# EAGLE design TSAL_logic (EAGLE 9.6.2)

## Sheet 1 of 2
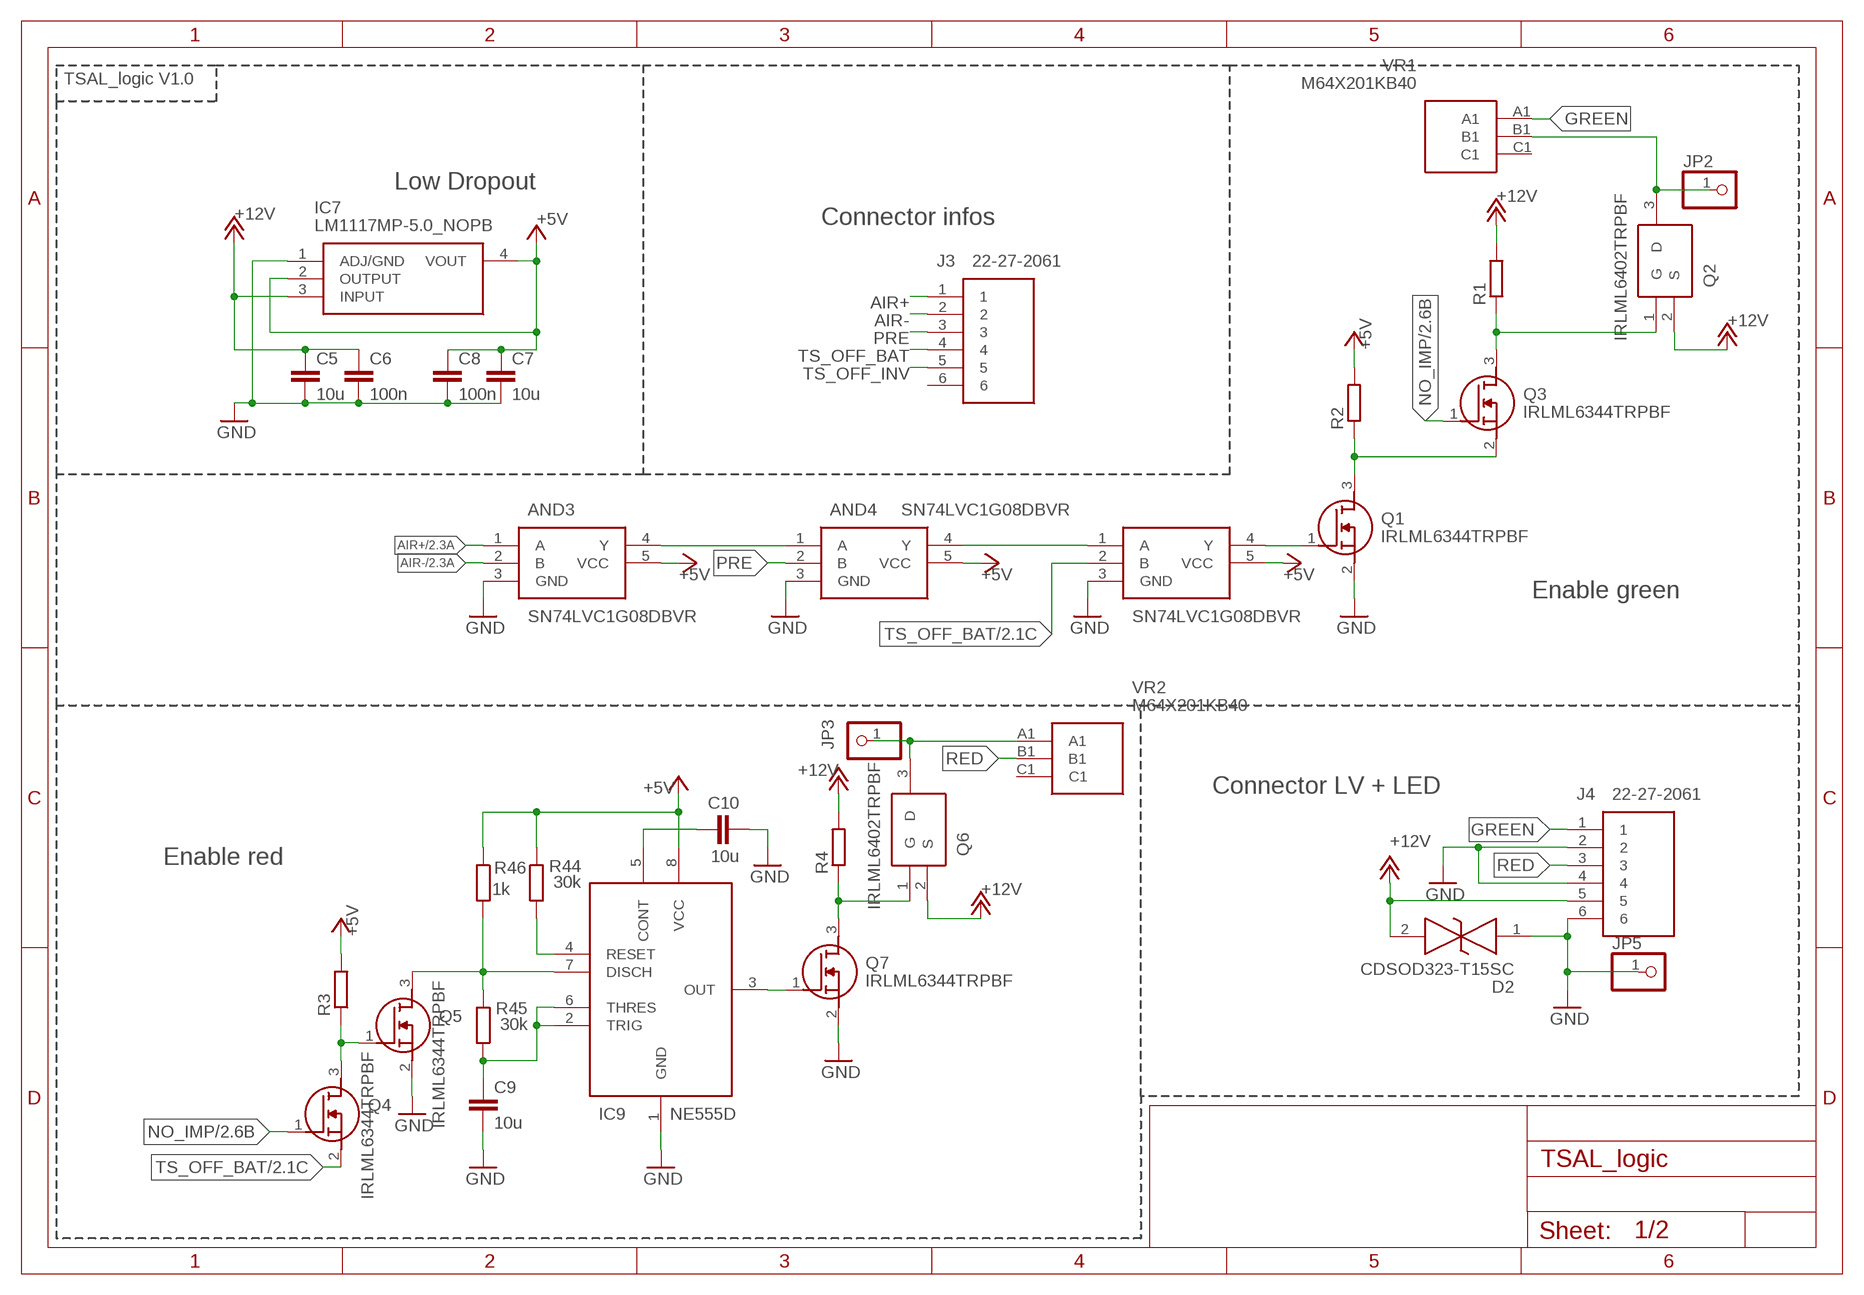
[diagram p0: schematic, sheet 1]

### Parts
AND3  SN74LVC1G08DBVR  [SOT95P280X145-5N]
AND4  SN74LVC1G08DBVR  [SOT95P280X145-5N]
AND5  SN74LVC1G08DBVR  [SOT95P280X145-5N]
C5  10u  C-EUC1206  [C1206]
C6  100n  C-EUC0603  [C0603]
C7  10u  C-EUC1206  [C1206]
C8  100n  C-EUC0603  [C0603]
C9  10u  C-EUC1206  [C1206]
C10  10u  C-EUC1206  [C1206]
D2  CDSOD323-T15SC  [SOD-323]
IC7  LM1117MP-5.0_NOPB  [SOT230P700X180-4N]
IC9  NE555D  [SOIC127P600X175-8N]
J3  22-27-2061  [HDRV6W64P0X254_1X6_1524X580X11]
J4  22-27-2061  [HDRV6W64P0X254_1X6_1524X580X11]
JP2  PINHD-1X1  [1X01]
JP3  PINHD-1X1  [1X01]
JP5  PINHD-1X1  [1X01]
Q1  IRLML6344TRPBF  [SOT95P237X112-3N]
Q2  IRLML6402TRPBF  [SOT95P237X112-3N]
Q3  IRLML6344TRPBF  [SOT95P237X112-3N]
Q4  IRLML6344TRPBF  [SOT95P237X112-3N]
Q5  IRLML6344TRPBF  [SOT95P237X112-3N]
Q6  IRLML6402TRPBF  [SOT95P237X112-3N]
Q7  IRLML6344TRPBF  [SOT95P237X112-3N]
R1  R-EU_R0603  [R0603]
R2  R-EU_R0603  [R0603]
R3  R-EU_R0603  [R0603]
R4  R-EU_R0603  [R0603]
R44  30k  R-EU_R1206  [R1206]
R45  30k  R-EU_R1206  [R1206]
R46  1k  R-EU_R1206  [R1206]
VR1  M64X201KB40  [M64X201KB40]
VR2  M64X201KB40  [M64X201KB40]

### Nets
12VN$2 [12V]: Q2.1(G) Q3.3(D) R1.1
12VN$5 [12V]: Q6.1(G) Q7.3(D) R4.1
12VN$29 [12V]: JP2.1 Q2.3(D) VR1.B1
+5V [5V]: AND3.5(VCC) AND4.5(VCC) AND5.5(VCC) C7.1 C8.1 IC7.2(OUTPUT) IC7.4(VOUT) IC9.8(VCC) R2.2 R3.2 R44.1 R46.1 ; also sheet 2
+12V [12V]: C5.1 C6.1 D2.2 IC7.3(INPUT) J4.5 Q2.2(S) Q6.2(S) R1.2 R4.2
AIR+ [5V]: AND3.1(A) J3.1 ; also sheet 2
AIR- [5V]: AND3.2(B) J3.2 ; also sheet 2
GND [GROUND]: AND3.3(GND) AND4.3(GND) AND5.3(GND) C5.2 C6.2 C7.2 C8.2 C9.2 C10.2 D2.1 IC7.1(ADJ/GND) IC9.1(GND) J4.2 J4.4 J4.6 JP5.1 Q1.2(S) Q5.2(S) Q7.2(S) ; also sheet 2
GREEN [12V]: J4.1 VR1.A1
N$1 [5V]: Q1.3(D) Q3.2(S) R2.1
N$2 [12V]: JP3.1 Q6.3(D) VR2.A1
N$3 [5V]: Q4.3(D) Q5.1(G) R3.1
N$4 [5V]: IC9.3(OUT) Q7.1(G)
N$27 [5V]: AND4.4(Y) AND5.1(A)
N$53 [5V]: AND3.4(Y) AND4.1(A)
N$58 [5V]: AND5.4(Y) Q1.1(G)
N$61 [5V]: IC9.7(DISCH) Q5.3(D) R45.2 R46.2
N$62 [5V]: C9.1 IC9.2(TRIG) IC9.6(THRES) R45.1
N$64 [5V]: IC9.4(RESET) R44.2
N$66 [5V]: C10.1 IC9.5(CONT)
NO_IMP [5V]: Q3.1(G) Q4.1(G) ; also sheet 2
PRE [5V]: AND4.2(B) J3.3
RED [12V]: J4.3 VR2.B1
TS_OFF_BAT [5V]: AND5.2(B) J3.4 Q4.2(S) ; also sheet 2
TS_OFF_INV [5V]: J3.5 ; also sheet 2
Unconnected: J3.6 VR1.C1 VR2.C1

### Notes on the sheet
- TSAL_logic V1.0
- Low Dropout
- Connector infos
- Enable green
- Connector LV + LED
- Enable red

## Sheet 2 of 2
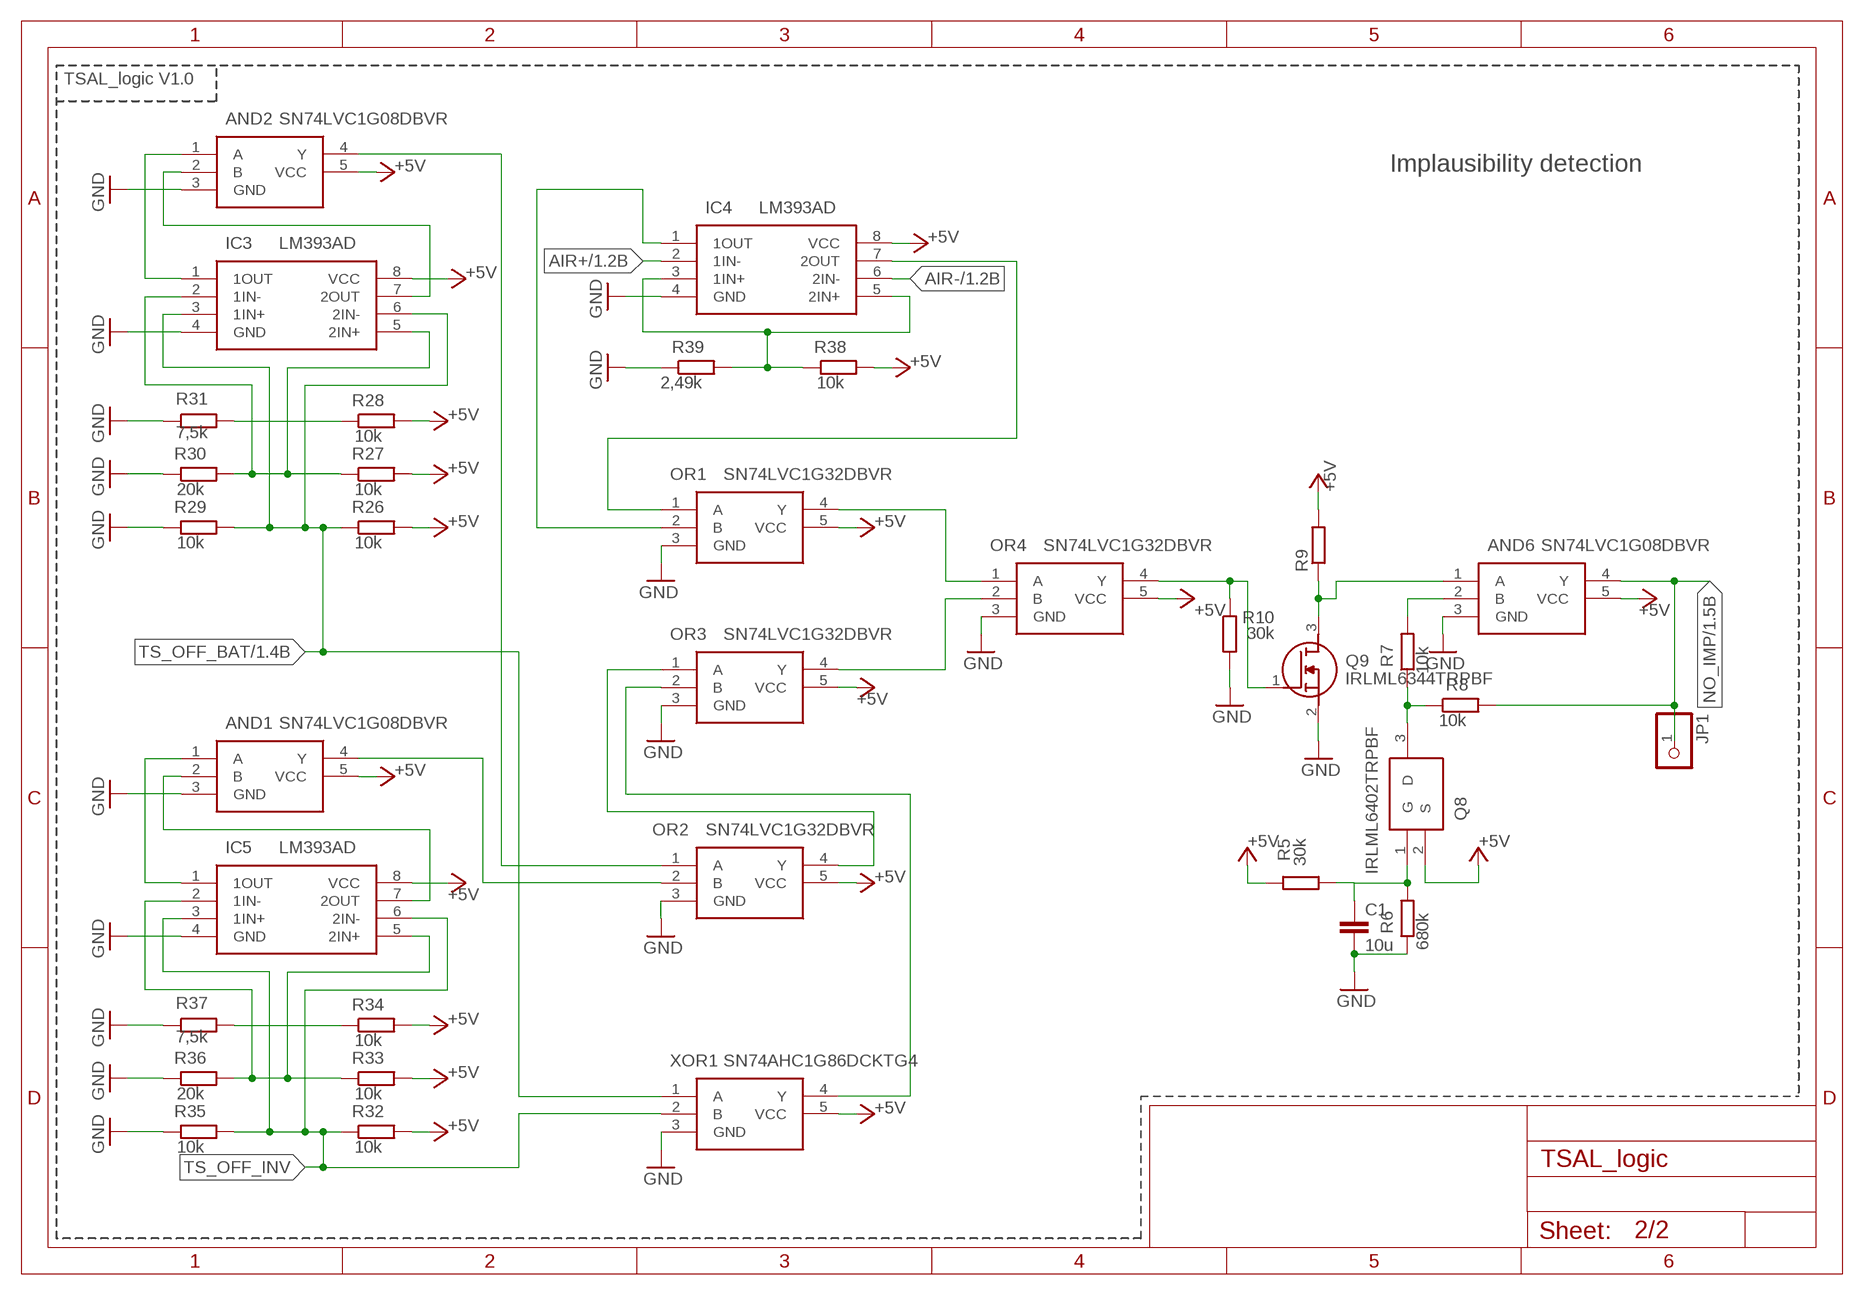
[diagram p1: schematic, sheet 2]

### Parts
AND1  SN74LVC1G08DBVR  [SOT95P280X145-5N]
AND2  SN74LVC1G08DBVR  [SOT95P280X145-5N]
AND6  SN74LVC1G08DBVR  [SOT95P280X145-5N]
C1  10u  C-EUC1206  [C1206]
IC3  LM393AD  [SOIC127P600X175-8N]
IC4  LM393AD  [SOIC127P600X175-8N]
IC5  LM393AD  [SOIC127P600X175-8N]
JP1  PINHD-1X1  [1X01]
OR1  SN74LVC1G32DBVR  [SOT95P280X145-5N]
OR2  SN74LVC1G32DBVR  [SOT95P280X145-5N]
OR3  SN74LVC1G32DBVR  [SOT95P280X145-5N]
OR4  SN74LVC1G32DBVR  [SOT95P280X145-5N]
Q8  IRLML6402TRPBF  [SOT95P237X112-3N]
Q9  IRLML6344TRPBF  [SOT95P237X112-3N]
R5  30k  R-EU_R1206  [R1206]
R6  680k  R-EU_R0603  [R0603]
R7  10k  R-EU_R0603  [R0603]
R8  10k  R-EU_R0603  [R0603]
R9  R-EU_R0603  [R0603]
R10  30k  R-EU_R1206  [R1206]
R26  10k  R-EU_R0603  [R0603]
R27  10k  R-EU_R0603  [R0603]
R28  10k  R-EU_R0603  [R0603]
R29  10k  R-EU_R0603  [R0603]
R30  20k  R-EU_R0603  [R0603]
R31  7,5k  R-EU_R0805  [R0805]
R32  10k  R-EU_R0603  [R0603]
R33  10k  R-EU_R0603  [R0603]
R34  10k  R-EU_R0603  [R0603]
R35  10k  R-EU_R0603  [R0603]
R36  20k  R-EU_R0603  [R0603]
R37  7,5k  R-EU_R0805  [R0805]
R38  10k  R-EU_R0603  [R0603]
R39  2,49k  R-EU_R0603  [R0603]
XOR1  SN74AHC1G86DCKTG4  [SOT65P210X110-5N]

### Nets
+5V [5V]: AND1.5(VCC) AND2.5(VCC) AND6.5(VCC) IC3.8(VCC) IC4.8(VCC) IC5.8(VCC) OR1.5(VCC) OR2.5(VCC) OR3.5(VCC) OR4.5(VCC) Q8.2(S) R5.1 R9.2 R26.2 R27.2 R28.2 R32.2 R33.2 R34.2 R38.2 XOR1.5(VCC) ; also sheet 1
AIR+ [5V]: IC4.2(1IN-) ; also sheet 1
AIR- [5V]: IC4.6(2IN-) ; also sheet 1
GND [GROUND]: AND1.3(GND) AND2.3(GND) AND6.3(GND) C1.2 IC3.4(GND) IC4.4(GND) IC5.4(GND) OR1.3(GND) OR2.3(GND) OR3.3(GND) OR4.3(GND) Q9.2(S) R6.1 R10.2 R29.1 R30.1 R31.1 R35.1 R36.1 R37.1 R39.1 XOR1.3(GND) ; also sheet 1
N$6 [5V]: OR2.4(Y) OR3.1(A)
N$7 [5V]: OR4.4(Y) Q9.1(G) R10.1
N$8 [5V]: C1.1 Q8.1(G) R5.2 R6.2
N$9 [5V]: AND6.2(B) R7.2
N$10 [5V]: Q8.3(D) R7.1 R8.1
N$11 [5V]: IC4.7(2OUT) OR1.1(A)
N$13 [5V]: AND1.4(Y) OR2.2(B)
N$14 [5V]: OR3.2(B) XOR1.4(Y)
N$15 [5V]: OR1.4(Y) OR4.1(A)
N$16 [5V]: AND6.1(A) Q9.3(D) R9.1
N$30 [5V]: R28.1 R31.2
N$31 [5V]: IC3.2(1IN-) IC3.5(2IN+) R27.1 R30.2
N$33 [5V]: AND2.1(A) IC3.1(1OUT)
N$34 [5V]: AND2.2(B) IC3.7(2OUT)
N$35 [5V]: R34.1 R37.2
N$36 [5V]: IC5.2(1IN-) IC5.5(2IN+) R33.1 R36.2
N$38 [5V]: AND1.2(B) IC5.7(2OUT)
N$39 [5V]: AND1.1(A) IC5.1(1OUT)
N$40 [5V]: IC4.3(1IN+) IC4.5(2IN+) R38.1 R39.2
N$43 [5V]: IC4.1(1OUT) OR1.2(B)
N$50 [5V]: AND2.4(Y) OR2.1(A)
N$63 [5V]: OR3.4(Y) OR4.2(B)
NO_IMP [5V]: AND6.4(Y) JP1.1 R8.2 ; also sheet 1
TS_OFF_BAT [5V]: IC3.3(1IN+) IC3.6(2IN-) R26.1 R29.2 XOR1.1(A) ; also sheet 1
TS_OFF_INV [5V]: IC5.3(1IN+) IC5.6(2IN-) R32.1 R35.2 XOR1.2(B) ; also sheet 1

### Notes on the sheet
- TSAL_logic V1.0
- Implausibility detection

## Library data of the parts
AND1-AND6 = SamacSys_Parts:SN74LVC1G08DBVR: SN74LVC1G08 Single 2-Input Positive-AND Gate Source: Datasheet <http://www.ti.com/lit/ds/symlink/sn74lvc1g08.pdf>; ARROW_PART_NUMBER: SN74LVC1G08DBVR; ARROW_PRICE-STOCK: https://www.arrow.com/en/products/sn74lvc1g08dbvr/texas-instruments?region=nac; DESCRIPTION: SN74LVC1G08 Single 2-Input Positive-AND Gate; HEIGHT: 1.45mm; MANUFACTURER_NAME: Texas Instruments; MANUFACTURER_PART_NUMBER: SN74LVC1G08DBVR; MOUSER_PART_NUMBER: 595-SN74LVC1G08DBVR; MOUSER_PRICE-STOCK: https://www.mouser.co.uk/ProductDetail/Texas-Instruments/SN74LVC1G08DBVR?qs=8yeEWhuAOtNjtL049wSCoQ%3D%3D
C1 C5-C10 = rcl:C-EU: CAPACITOR, European symbol; SPICEPREFIX: C
D2 = SamacSys_Parts:CDSOD323-T15SC: TVS Diode ESD 15V BiDirectional SOD323 Bourns CDSOD323-T15SC Bi-Directional TVS Diode, 400W peak, 2-Pin SOD-323 Source: Datasheet <http://uk.rs-online.com/web/p/products/7734570>; ALLIED_NUMBER: 70410859; DESCRIPTION: TVS Diode ESD 15V BiDirectional SOD323 Bourns CDSOD323-T15SC Bi-Directional TVS Diode, 400W peak, 2-Pin SOD-323; HEIGHT: mm; MANUFACTURER_NAME: Bourns; MANUFACTURER_PART_NUMBER: CDSOD323-T15SC; RS_PART_NUMBER: 7734570; RS_PRICE-STOCK: http://uk.rs-online.com/web/p/products/7734570
IC3-IC5 = SamacSys_Parts:LM393AD: LM393ADG4, Dual Comparator Open Collector 1.3s 2-kanalers 3, 5, 9, 12, 15, 18, 24, 28V 8-Pin SOIC Source: Datasheet <http://uk.rs-online.com/web/p/products/5171905P>; DESCRIPTION: LM393ADG4, Dual Comparator Open Collector 1.3s 2-kanalers 3, 5, 9, 12, 15, 18, 24, 28V 8-Pin SOIC; HEIGHT: 1.75mm; MANUFACTURER_NAME: Texas Instruments; MANUFACTURER_PART_NUMBER: LM393AD; RS_PART_NUMBER: 5171905P; RS_PRICE-STOCK: http://uk.rs-online.com/web/p/products/5171905P
IC7 = SamacSys_Parts:LM1117MP-5.0_NOPB: LM1117MP-5.0/NOPB, Low Dropout Voltage Regulator, 1.5A, 5 V +/-1%, 4-Pin SOT-223 Source: Datasheet <https://datasheet.datasheetarchive.com/originals/distributors/Datasheets-SFU2/DSASFU100036103.pdf>; ARROW_PART_NUMBER: LM1117MP-5.0/NOPB; ARROW_PRICE-STOCK: https://www.arrow.com/en/products/lm1117mp-5.0nopb/texas-instruments?region=nac; DESCRIPTION: LM1117MP-5.0/NOPB, Low Dropout Voltage Regulator, 1.5A, 5 V +/-1%, 4-Pin SOT-223; HEIGHT: 1.8mm; MANUFACTURER_NAME: Texas Instruments; MANUFACTURER_PART_NUMBER: LM1117MP-5.0/NOPB; MOUSER_PART_NUMBER: 926-LM1117MP-5.0NOPB; MOUSER_PRICE-STOCK: https://www.mouser.co.uk/ProductDetail/Texas-Instruments/LM1117MP-50-NOPB?qs=X1J7HmVL2ZFGlzwnAaPsKg%3D%3D
IC9 = SamacSys_Parts:NE555D: NE555DG4, Timer, 4.5 to 16V, 8-Pin SOIC-8 Source: Datasheet <http://uk.rs-online.com/web/p/products/6624661P>; DESCRIPTION: NE555DG4, Timer, 4.5 to 16V, 8-Pin SOIC-8; HEIGHT: 1.75mm; MANUFACTURER_NAME: Texas Instruments; MANUFACTURER_PART_NUMBER: NE555D; RS_PART_NUMBER: 6624661P; RS_PRICE-STOCK: http://uk.rs-online.com/web/p/products/6624661P
J3 J4 = SamacSys_Parts:22-27-2061: 6way straight PCB header w/friction lock Molex KK Series, Series Number 6410, 2.54mm Pitch 6 Way 1 Row Straight PCB Header, Solder Termination, 4A Source: Datasheet <http://uk.rs-online.com/web/p/products/4838506P>; DESCRIPTION: 6way straight PCB header w/friction lock Molex KK Series, Series Number 6410, 2.54mm Pitch 6 Way 1 Row Straight PCB Header, Solder Termination, 4A; HEIGHT: 11.7mm; MANUFACTURER_NAME: Molex; MANUFACTURER_PART_NUMBER: 22-27-2061; RS_PART_NUMBER: 4838506P; RS_PRICE-STOCK: http://uk.rs-online.com/web/p/products/4838506P
JP1-JP3 JP5 = pinhead:PINHD-1X1: PIN HEADER
OR1 OR2 OR4 = SamacSys_Parts:SN74LVC1G32DBVR: Texas Instruments SN74LVC1G32DBVR, 2-Input OR Logic Gate, 1.65 5.5 V, 5-Pin SOT-23 Source: Datasheet <http://uk.rs-online.com/web/p/products/0527669>; DESCRIPTION: Texas Instruments SN74LVC1G32DBVR, 2-Input OR Logic Gate, 1.65 5.5 V, 5-Pin SOT-23; HEIGHT: 1.45mm; MANUFACTURER_NAME: Texas Instruments; MANUFACTURER_PART_NUMBER: SN74LVC1G32DBVR; RS_PART_NUMBER: 0527669; RS_PRICE-STOCK: http://uk.rs-online.com/web/p/products/0527669
OR3 = SamacSys_Parts:SN74LVC1G32DBVR: Texas Instruments SN74LVC1G32DBVR, 2-Input OR Logic Gate, 1.65 5.5 V, 5-Pin SOT-23 Source: Datasheet <http://uk.rs-online.com/web/p/products/0527669>; DESCRIPTION: Texas Instruments SN74LVC1G32DBVR, 2-Input OR Logic Gate, 1.65 5.5 V, 5-Pin SOT-23; HEIGHT: 1.45mm; MANUFACTURER_NAME: Texas Instruments; MANUFACTURER_PART_NUMBER: SN74LVC1G32DBVR; RS_PART_NUMBER: 0527669; RS_PRICE-STOCK: http://uk.rs-online.com/web/p/products/0527669; SPICEPREFIX: X
Q1 Q3-Q5 Q7 Q9 = SamacSys_Parts:IRLML6344TRPBF: IRLML6344TRPBF N-channel MOSFET Transistor, 5 A, 30 V, 3-Pin SOT-23 Source: Datasheet <http://uk.rs-online.com/web/p/products/7377225P>; ALLIED_NUMBER: 70411467; DESCRIPTION: IRLML6344TRPBF N-channel MOSFET Transistor, 5 A, 30 V, 3-Pin SOT-23; HEIGHT: 1.12mm; MANUFACTURER_NAME: Infineon; MANUFACTURER_PART_NUMBER: IRLML6344TRPBF; RS_PART_NUMBER: 7377225P; RS_PRICE-STOCK: http://uk.rs-online.com/web/p/products/7377225P
Q2 Q6 Q8 = SamacSys_Parts:IRLML6402TRPBF: MOSFET MOSFT P-Ch -3.7A 65mOhm 8nC Log Lvl Source: Datasheet <http://uk.rs-online.com/web/p/products/0301322P>; ALLIED_NUMBER: 70017407; DESCRIPTION: MOSFET MOSFT P-Ch -3.7A 65mOhm 8nC Log Lvl; HEIGHT: 1.12mm; MANUFACTURER_NAME: Infineon; MANUFACTURER_PART_NUMBER: IRLML6402TRPBF; RS_PART_NUMBER: 0301322P; RS_PRICE-STOCK: http://uk.rs-online.com/web/p/products/0301322P
R1-R10 R26-R39 R44-R46 = rcl:R-EU_: RESISTOR, European symbol; SPICEPREFIX: R
VR1 VR2 = SamacSys_Parts:M64X201KB40: Trimmer Resistors - Through Hole 3/8"SQ 200ohms Multi Turn Cermet Source: Datasheet <https://www.mouser.co.uk/datasheet/2/427/64-239937.pdf>; ARROW_PART_NUMBER: M64X201KB40; ARROW_PRICE-STOCK: https://www.arrow.com/en/products/m64x201kb40/vishay; DESCRIPTION: Trimmer Resistors - Through Hole 3/8"SQ 200ohms Multi Turn Cermet; HEIGHT: 9.8mm; MANUFACTURER_NAME: Vishay; MANUFACTURER_PART_NUMBER: M64X201KB40; MOUSER_PART_NUMBER: 594-64X201; MOUSER_PRICE-STOCK: https://www.mouser.com/Search/Refine.aspx?Keyword=594-64X201
XOR1 = SamacSys_Parts:SN74AHC1G86DCKTG4: Logic Gates Single 2 Input Exclusive OR Gate Source: Datasheet <https://www.ti.com/general/docs/suppproductinfo.tsp?distId=10&gotoUrl=http://www.ti.com/lit/gpn/sn74ahc1g86>; ARROW_PART_NUMBER: SN74AHC1G86DCKTG4; ARROW_PRICE-STOCK: https://www.arrow.com/en/products/sn74ahc1g86dcktg4/texas-instruments; DESCRIPTION: Logic Gates Single 2 Input Exclusive OR Gate; HEIGHT: 1.1mm; MANUFACTURER_NAME: Texas Instruments; MANUFACTURER_PART_NUMBER: SN74AHC1G86DCKTG4; MOUSER_PART_NUMBER: 595-74AHC1G86DCKTG4; MOUSER_PRICE-STOCK: https://www.mouser.co.uk/ProductDetail/Texas-Instruments/SN74AHC1G86DCKTG4?qs=E8lYj0tdJGGGs7zAY6mT0w%3D%3D

## Net classes
1 GROUND: width 0.5 mm, drill 0.401 mm, clearance 0.051 mm
2 12V: width 1 mm, drill 0.401 mm, clearance 0.051 mm
4 5V: width 0.5 mm, drill 0.401 mm, clearance 0.051 mm

## Board
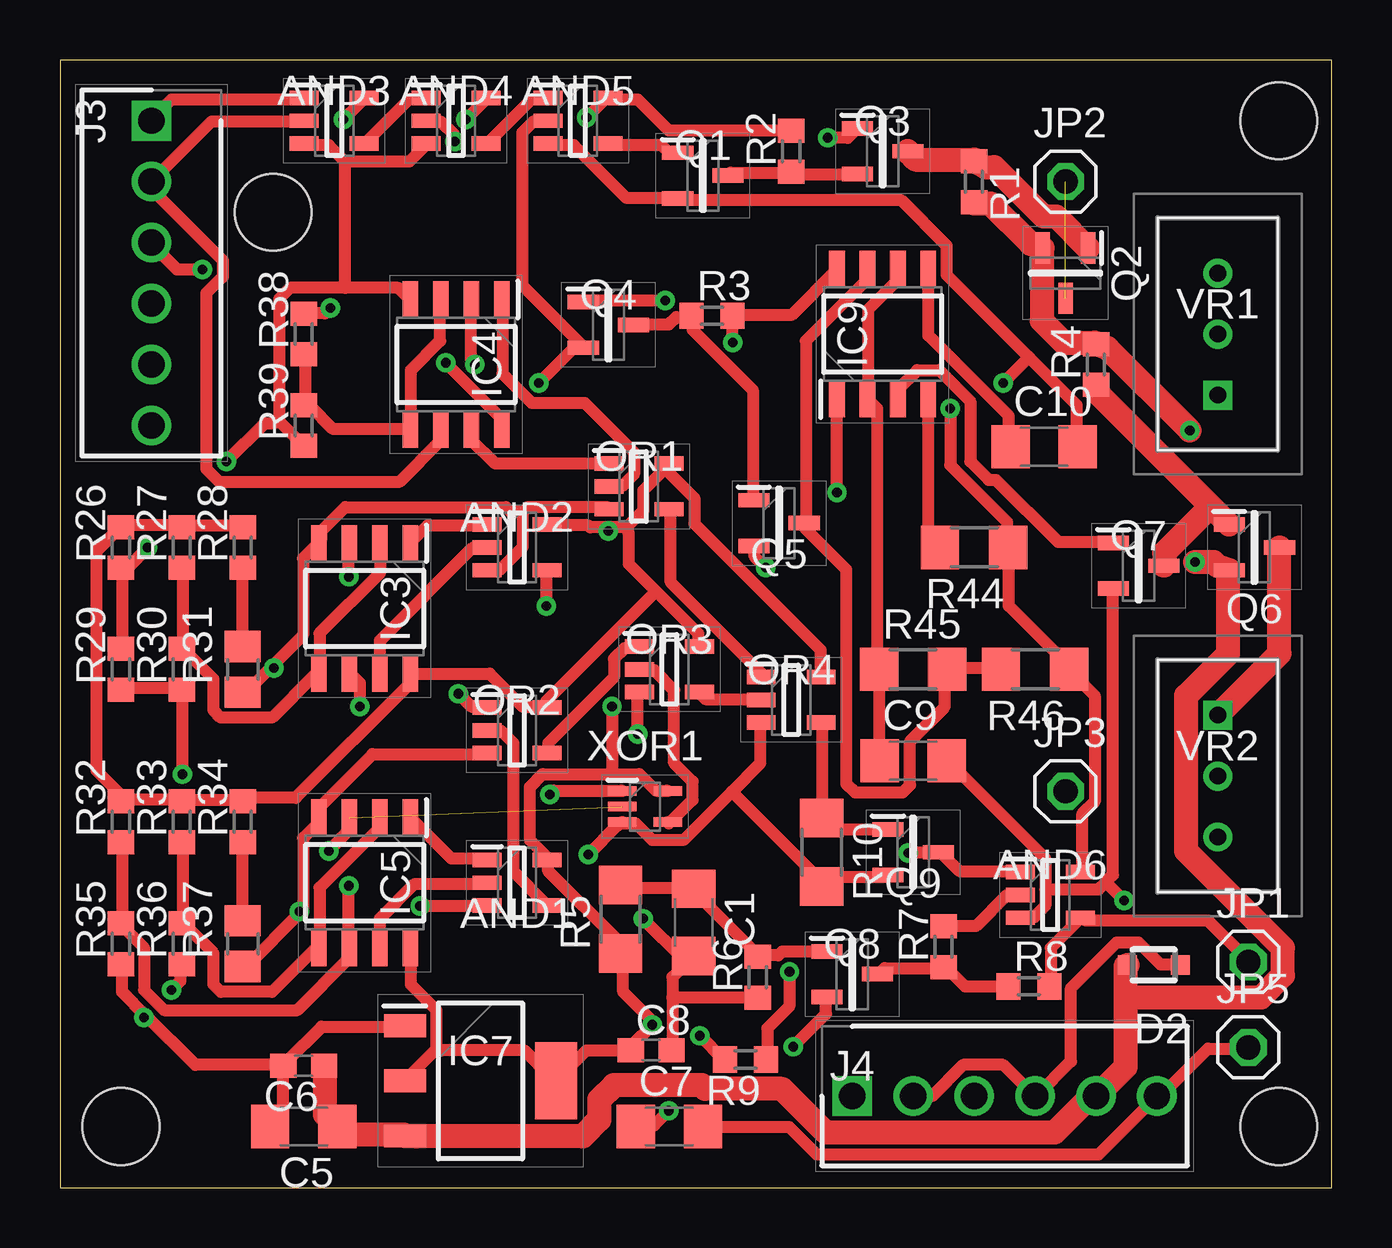
[diagram p2: board, top side]
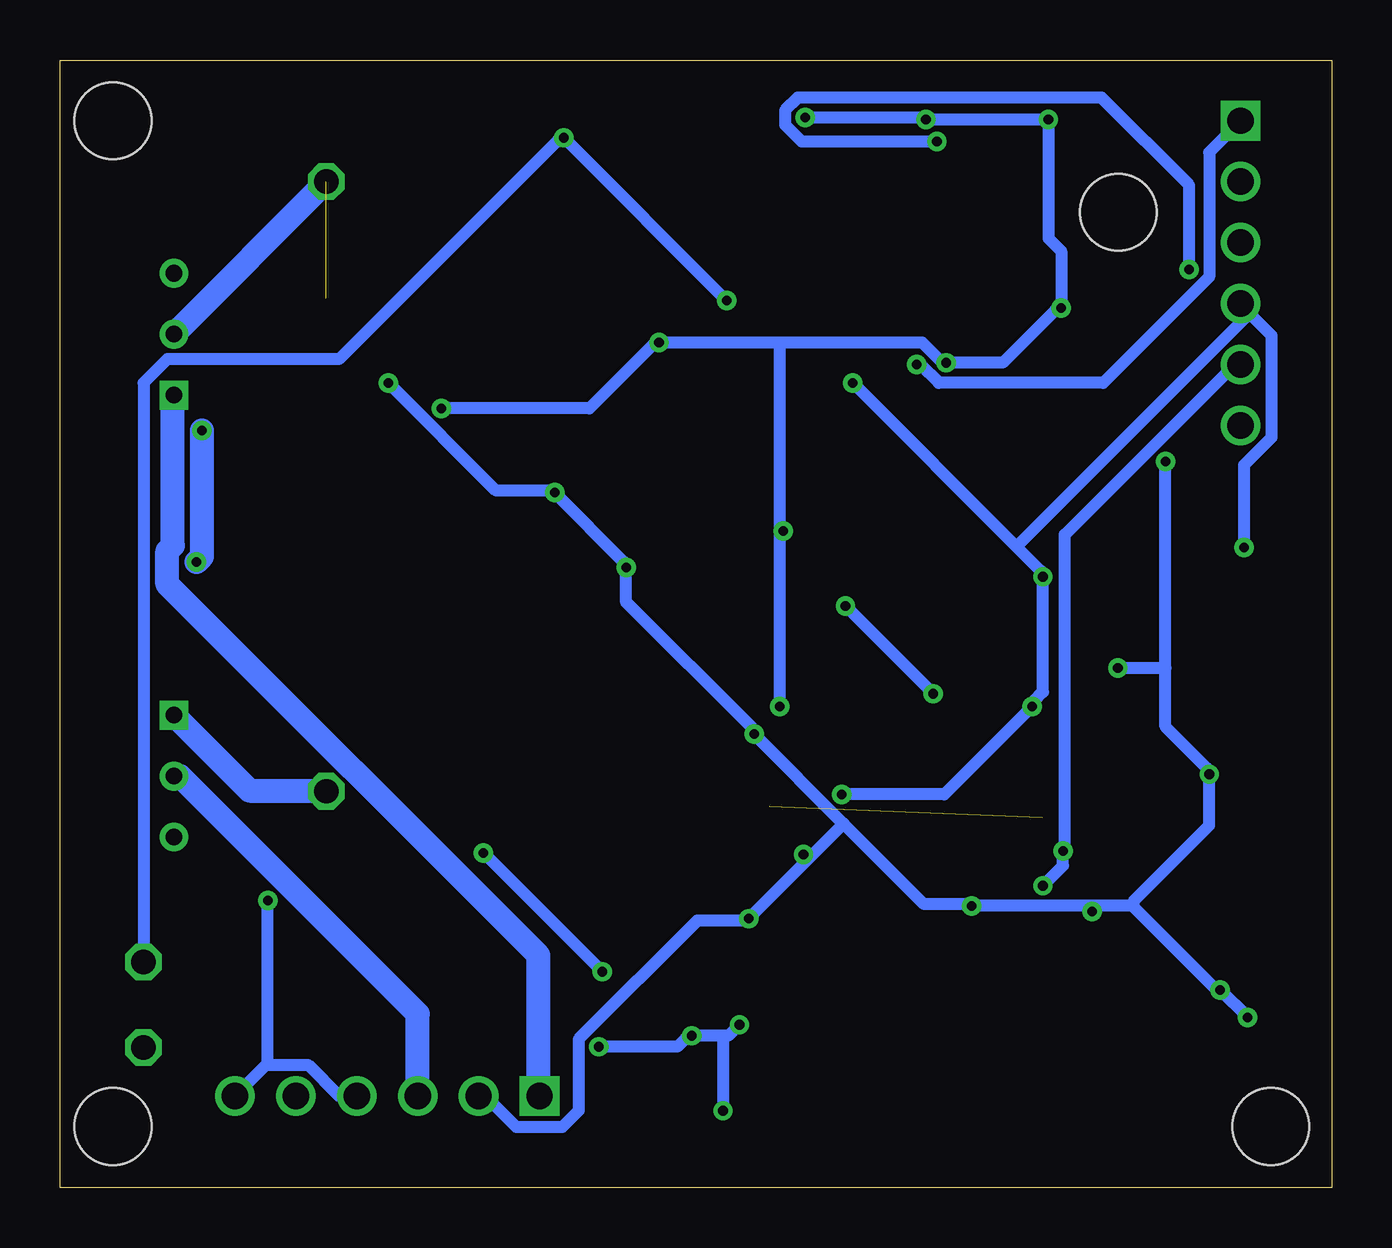
[diagram p3: board, bottom side, seen from below]

Size 53.01 x 46.98 mm. Coordinates in mm from the lower left corner, seen from the top.
Outline: 0,0 53.01,0 53.01,46.98 0,46.98 0,0
Copper layers (1*16): Top 0.035mm / dielectric 1.5mm / Bottom 0.035mm
Design rules "default": minimum track width 6mil, minimum drill 0.35mm, track to track 6mil, track to pad 6mil, pad to pad 6mil, via to via 6mil, smd to smd 6mil, copper to edge 40mil, drill to drill 6mil, minimum pad ring 10mil, minimum via ring 8mil, stop-mask expansion 4mil, vias tented up to drill 0mil, thermal gap 10mil
Holes 3.2 mm at 2.54,2.54 50.8,2.54 50.8,44.45 8.89,40.64

### Footprints (pad centres in the part's own frame; a part is rotated, then mirrored left to right if it is on the bottom)
SOT95P280X145-5N = smd 1.2 x 0.6: 1 -1.25,0.95; 2 -1.25,0; 3 -1.25,-0.95; 4 1.25,-0.95; 5 1.25,0.95
C1206 = smd 1.6 x 1.8: 1 -1.4,0; 2 1.4,0
C0603 = smd 1.1 x 1: 1 -0.85,0; 2 0.85,0
SOD-323 = smd 0.8 x 0.8: 1 -1.1,0; 2 1.1,0
SOIC127P600X175-8N = smd 1.528 x 0.65: 1 -2.711,1.905; 2 -2.711,0.635; 3 -2.711,-0.635; 4 -2.711,-1.905; 5 2.711,-1.905; 6 2.711,-0.635; 7 2.711,0.635; 8 2.711,1.905
SOT230P700X180-4N = smd 1.75 x 0.95: 1 -3.15,2.3; 2 -3.15,0; 3 -3.15,-2.3 | smd 1.75 x 3.2: 4 3.15,0
HDRV6W64P0X254_1X6_1524X580X11 = drill 1.1 pad 1.65 square: 1 0,0 | drill 1.1 pad 1.65: 2 2.54,0; 3 5.08,0; 4 7.62,0; 5 10.16,0; 6 12.7,0
1X01 = drill 1.016 octagon: 1 0,0
SOT95P237X112-3N = smd 1.3 x 0.6: 1 -1.05,0.95; 2 -1.05,-0.95; 3 1.05,0
R0603 = smd 1 x 1.1: 1 -0.85,0; 2 0.85,0
R1206 = smd 1.6 x 1.803: 1 -1.422,0; 2 1.422,0
R0805 = smd 1.3 x 1.5: 1 -0.95,0; 2 0.95,0
M64X201KB40 = drill 0.7 pad 1.2 square: A1 0,0 | drill 0.7 pad 1.2: B1 0,-2.54; C1 0,-5.08
SOT65P210X110-5N = smd 1.2 x 0.4: 1 -0.95,0.65; 2 -0.95,0; 3 -0.95,-0.65; 4 0.95,-0.65; 5 0.95,0.65

### Placement (x,y rotation side)
AND1  19.05,12.7 0 top
AND2  19.05,26.67 0 top
AND3  11.43,44.45 0 top
AND4  16.51,44.45 0 top
AND5  21.59,44.45 0 top
AND6  41.27,12.19 0 top
C1  26.42,11.05 270 top
C5  10.16,2.54 180 top
C6  10.16,5.08 180 top
C7  25.4,2.54 0 top
C8  24.64,5.71 0 top
C9  35.56,17.78 0 top
C10  41.02,30.86 0 top
D2  45.59,9.27 180 top
IC3  12.7,24.13 270 top
IC4  16.51,34.29 270 top
IC5  12.7,12.7 270 top
IC7  17.53,4.45 0 top
IC9  34.29,35.56 90 top
J3  3.81,44.45 270 top
J4  33.02,3.81 0 top
JP1  49.53,9.4 0 top
JP2  41.91,41.91 0 top
JP3  41.91,16.51 0 top
JP5  49.53,5.84 0 top
OR1  24.13,29.21 0 top
OR2  19.05,19.05 0 top
OR3  25.4,21.59 0 top
OR4  30.48,20.32 0 top
Q1  26.8,42.16 0 top
Q2  41.91,38.1 270 top
Q3  34.29,43.18 0 top
Q4  22.86,35.94 0 top
Q5  29.97,27.69 0 top
Q6  49.78,26.67 0 top
Q7  44.96,25.91 0 top
Q8  33.02,8.89 0 top
Q9  35.56,13.97 0 top
R1  38.1,41.91 270 top
R2  30.48,43.18 90 top
R3  27.18,36.32 0 top
R4  43.18,34.29 90 top
R5  23.37,11.18 90 top
R6  29.08,8.76 90 top
R7  36.83,10.03 90 top
R8  40.39,8.38 0 top
R9  28.57,5.33 180 top
R10  31.75,13.97 270 top
R26  2.54,26.67 90 top
R27  5.08,26.67 90 top
R28  7.62,26.67 90 top
R29  2.54,21.59 90 top
R30  5.08,21.59 90 top
R31  7.62,21.59 90 top
R32  2.54,15.24 90 top
R33  5.08,15.24 90 top
R34  7.62,15.24 90 top
R35  2.54,10.16 90 top
R36  5.08,10.16 90 top
R37  7.62,10.16 90 top
R38  10.16,35.56 90 top
R39  10.16,31.75 90 top
R44  38.1,26.67 180 top
R45  35.56,21.59 0 top
R46  40.64,21.59 180 top
VR1  48.26,33.02 180 top
VR2  48.26,19.68 0 top
XOR1  24.38,15.88 0 top

### Tracks (layer width: path | path; a pad name or v marks a point on that pad's centre or on a via)
12VN$2
  Top 1: Q3.3 35.36,43.13 35.66,42.82 38.1,42.82 R1.1 38.56,42.52 38.94,42.52 41,40.46 41.53,40.46 42.82,39.17 Q2.1
12VN$5
  Top 1: 47.97,28.38 48.69,27.66 Q6.1 | 47.97,28.38 43.2,33.15 43.2,33.38 R4.1 | 47.97,28.38 46.02,26.44 46.02,25.91 Q7.3
12VN$29  (1 unrouted)
  Bottom 1: JP2.1 VR1.B1
+5V  (via drill 0.4)
  Top 0.5: 23.62,27.51 22.86,27.51 | 22.86,27.51 22.1,27.51 22.02,27.58 20.34,27.58 AND2.5 | 23.62,27.51 24.31,28.19 24.31,29.03 25.22,29.95 | 25.22,29.95 25.38,30.1 OR1.5 | 25.22,29.95 26.44,28.73 26.44,27.66 31.7,22.4 31.7,21.34 OR4.5 | 24.84,24.84 23.7,25.98 23.7,27.28 23.62,27.51 | 24.84,24.84 26.59,23.09 26.59,22.55 OR3.5 | R28.2 7.62,27.58 5.33,27.58 R27.2 5.03,27.58 2.59,27.58 R26.2 2.36,27.36 1.52,26.52 1.52,17.37 2.52,16.38 R32.2 2.59,16.15 5.03,16.15 R33.2 5.33,16.15 7.62,16.15 R34.2 7.85,16.23 9.83,16.23 14.55,20.95 14.55,21.18 IC3.8 14.63,21.41 17.91,21.41 19.28,20.04 20.27,20.04 OR2.5 20.27,20.27 24.84,24.84 | 23.01,17.22 20.12,17.22 19.58,16.69 19.58,14.48 20.19,13.87 AND1.5 20.34,13.64 20.34,13.18 23.32,10.21 23.32,9.83 R5.1 23.47,9.53 23.47,8.15 24.61,7.01 v24.69,6.78 23.85,5.94 C8.1 21.95,5.71 20.73,4.5 IC7.4 20.5,4.57 19.36,5.71 15.93,5.71 15.7,5.79 | 23.01,17.22 24.16,17.22 24.84,16.54 25.3,16.54 XOR1.5 | 15.7,5.79 15.7,7.39 14.63,8.46 14.63,9.98 IC5.8 | 15.7,5.79 14.4,4.5 IC7.2 | v26.67,6.33 27.66,5.33 R9.2 | v30.56,5.87 31.93,7.24 31.93,7.92 Q8.2 | v25.38,3.2 24.77,2.59 24,2.59 C7.1 | AND6.5 42.6,13.18 42.6,15.54 43.13,16.08 43.13,20.5 42.06,21.57 R46.1 41.99,21.79 39.55,24.23 39.55,26.67 R44.1 39.47,26.9 39.47,27.74 37.11,30.1 v37.11,32.46 | R2.2 30.48,44.04 25.38,44.04 24.08,45.34 22.86,45.34 AND5.5 22.63,45.26 v21.95,44.58 | IC9.8 32.38,38.25 30.48,36.35 28.04,36.35 R3.2 28.04,36.12 v28.04,35.2 | v11.28,36.65 11.05,36.42 10.21,36.42 R38.2 | v11.81,44.5 12.65,45.34 AND3.5 | v16.92,44.5 17.75,45.34 AND4.5 | v16.08,34.37 18.36,32.08 18.36,31.62 IC4.8
  Top 0.5: v23.01,20.04 23.01,17.22 | v22.86,27.36 22.86,27.51
  Bottom 0.5: 25.38,6.33 25.15,6.33 v24.69,6.78 | 25.38,6.33 v26.67,6.33 26.9,6.25 27.28,5.87 v30.56,5.87 | 25.38,6.33 v25.38,3.2 | 23.01,35.2 17.07,35.2 16.31,34.44 v16.08,34.37 13.72,34.37 11.51,36.58 v11.28,36.65 11.28,39.01 11.81,39.55 v11.81,44.5 v16.92,44.5 17.14,44.58 v21.95,44.58 | 23.01,35.2 v28.04,35.2 28.27,35.13 30.94,32.46 v37.11,32.46 | 23.01,35.2 23.01,27.36 | 23.01,27.36 v23.01,20.04 | v22.86,27.36 23.01,27.36
+12V  (via drill 0.4)
  Top 1: 40.92,39.09 40.92,36.12 41.83,35.2 43.13,35.2 R4.2 43.66,34.98 v47.09,31.55 | 40.92,39.09 Q2.2 | R1.2 38.1,41 38.79,41 40.46,39.32 40.92,39.09 | C6.1 11.05,5.03 11.05,3.05 11.51,2.59 C5.1 12.04,2.36 12.19,2.21 14.33,2.21 IC7.3 14.86,2.13 21.79,2.13 22.48,2.82 22.48,3.66 23.09,4.27 26.75,4.27 26.9,4.12 30.1,4.12 31.93,2.29 41.45,2.29 42.75,3.58 J4.5 43.2,3.81 44.42,5.03 44.42,7.92 | 44.42,7.92 44.42,9.22 D2.2 | 44.42,7.92 50.06,7.92 50.98,8.84 50.98,9.98 46.94,14.02 46.94,20.5 48.69,22.25 48.69,25.68 Q6.2 48.23,25.91 48.08,26.06 v47.32,26.06
  Bottom 1: v47.09,31.55 47.09,26.29 v47.32,26.06
AIR+  (via drill 0.4)
  Top 0.5: AND3.1 10.13,45.34 4.65,45.34 3.81,44.5 J3.1 | IC4.2 17.14,34.44 v17.3,34.29
  Bottom 0.5: v17.3,34.29 17.14,34.29 16.38,33.53 9.53,33.53 5.11,37.95 5.11,43.13 3.81,44.42 J3.1
AIR-
  Top 0.5: AND3.2 10.13,44.42 6.33,44.42 J3.2 3.73,41.68 6.78,38.63 6.78,37.95 6.1,37.26 6.1,29.95 6.63,29.41 14.17,29.41 15.85,31.09 15.85,31.55 IC4.6
GND  (via drill 0.4)
  Top 0.5: 41.07,12.42 41.07,13.72 37.03,17.75 C9.2 | 41.07,12.42 41.07,11.73 40.62,11.28 40.08,11.28 AND6.3 | 43.59,12.72 43.28,12.42 41.07,12.42 | 43.59,12.72 43.89,13.03 43.89,24.92 Q7.2 | D2.1 46.63,9.3 45.87,9.3 44.96,10.21 44.04,10.21 42.14,8.31 42.14,5.26 40.69,3.81 J4.4 40.46,3.96 39.32,5.11 37.64,5.11 36.35,3.81 J4.2 | C7.2 26.82,2.52 30.4,2.52 31.55,1.37 43.28,1.37 J4.6 45.95,3.89 47.85,5.79 49.53,5.79 JP5.1 | v44.35,11.96 43.59,12.72 | AND5.3 20.34,43.43 21.41,43.43 23.62,41.22 25.68,41.22 Q1.2 25.98,41.15 35.05,41.15 36.96,39.24 36.96,38.02 40.39,34.59 | 40.39,34.59 42.37,32.61 42.37,30.86 C10.2 | 19.28,28.12 19.28,26.67 18.36,25.76 17.83,25.76 AND2.3 | 19.28,28.12 19.51,28.35 22.78,28.35 22.86,28.27 OR1.3 | 8.84,21.72 10.13,23.01 10.13,26.21 10.74,26.82 IC3.4 10.9,27.05 10.9,27.36 11.89,28.35 18.59,28.35 18.75,28.19 19.05,28.19 19.28,28.12 | 8.84,21.72 7.77,20.65 R31.1 | OR2.3 17.75,18.06 13.03,18.06 10.82,15.85 10.82,15.47 IC5.4 10.74,15.16 10.13,14.55 10.13,11.58 10.02,11.47 | 10.02,11.47 7.77,9.22 R37.1 | Q9.2 34.44,12.95 32.16,12.95 31.77,12.57 R10.2 31.7,12.8 28,16.5 | 28,16.5 29.18,17.68 29.18,19.36 OR4.3 | 28,16.5 25.98,14.48 24.69,14.48 24,15.16 23.47,15.16 XOR1.3 23.24,15.09 v22.02,13.87 | 11.89,42.75 11.2,43.43 10.21,43.43 AND3.3 | 11.89,42.75 14.55,42.75 15.24,43.43 AND4.3 | 9.14,31.93 10.13,30.94 R39.1 | 9.14,31.93 9.14,37.03 9.6,37.49 11.89,37.49 | 11.89,37.49 14.1,37.49 14.55,37.03 IC4.4 | 11.89,37.49 11.89,42.75 | 25.53,7.92 25.53,8.76 26.36,9.6 C1.2 25.98,9.53 v24.31,11.2 | 25.53,7.92 25.53,5.71 C8.2 | 25.53,7.92 29.03,7.92 R6.1 | R29.1 2.59,20.8 5.03,20.8 R30.1 5.11,20.5 v5.11,17.22
  Top 0.5: C6.2 9.3,5.03 9.3,3.12 8.76,2.59 C5.2 | 3.58,7.16 5.64,5.11 9.07,5.11 C6.2 | 3.58,7.16 2.59,8.15 2.59,9.3 R35.1 | v4.65,8.23 5.03,8.61 5.03,9.3 R36.1 | v3.5,7.09 3.58,7.16 | v15.01,11.73 17.75,11.73 AND1.3 | v24.08,18.9 24.08,20.57 OR3.3 | v29.41,25.83 28.96,26.29 28.96,26.67 Q5.2 | v32.38,28.96 IC9.1 | IC7.1 14.33,6.71 10.9,6.71 9.45,5.26 C6.2 | v6.93,30.25 8.53,31.85 8.91,31.85 9.14,31.93 | v9.98,11.51 10.02,11.47 | v8.91,21.64 8.84,21.72 | v39.32,33.53 40.39,34.59
  Bottom 0.5: J4.4 41.38,3.81 42.67,5.11 44.35,5.11 | 44.35,5.11 44.42,5.11 J4.6 | 44.35,5.11 v44.35,11.96 | v3.5,7.09 v4.65,8.23 4.88,8.31 8.31,11.73 | 8.31,11.73 9.98,11.73 | 9.98,11.73 v15.01,11.73 15.24,11.81 16.99,11.81 20.34,15.16 | 20.34,15.16 v24.08,18.9 24.16,19.13 29.41,24.38 v29.41,25.83 29.49,26.06 v32.38,28.96 32.61,29.03 34.82,29.03 v39.32,33.53 | 8.31,11.73 8.23,11.96 5.11,15.09 v5.11,17.22 5.18,17.45 6.93,19.2 6.93,21.64 | 20.34,15.16 21.79,13.72 | 21.79,13.72 v24.31,11.2 24.54,11.12 26.44,11.12 31.39,6.17 31.39,3.2 32.08,2.52 33.98,2.52 35.28,3.81 J4.2 | 6.93,21.64 v6.93,30.25 | v22.02,13.87 21.95,13.87 21.79,13.72 | v9.98,11.51 9.98,11.73 | 6.93,21.64 v8.91,21.64
GREEN
  Bottom 1: VR1.A1 48.31,32.99 48.31,26.75 48.54,26.52 48.54,25.15 33.07,9.68 33.07,3.81 J4.1
N$1
  Top 0.5: Q1.3 27.89,42.22 27.96,42.29 30.48,42.29 R2.1 30.71,42.22 33.22,42.22 Q3.2
N$2
  Top 1: VR2.A1 50.83,22.25 Q6.3
  Bottom 1: VR2.A1 45.11,16.54 41.91,16.54 JP3.1
N$3
  Top 0.5: Q4.3 23.93,35.97 25.38,35.97 25.68,36.27 26.29,36.27 R3.1 26.36,36.04 26.36,35.74 28.88,33.22 28.88,28.65 Q5.1
N$4
  Top 0.5: Q7.1 43.89,26.9 41.6,26.9 39.01,29.49 38.71,29.49 37.95,30.25 37.95,32.77 36.65,34.06 35.74,34.06 34.98,33.3 34.98,32.92 IC9.3
N$6
  Top 0.5: OR2.4 20.34,18.14 20.34,18.52 23.09,21.26 23.09,22.02 23.55,22.48 24.08,22.48 OR3.1
N$7
  Top 0.5: OR4.4 31.77,19.36 31.77,15.39 R10.1 32,15.32 32.38,14.94 34.44,14.94 Q9.1
N$8
  Top 0.5: Q8.1 31.93,9.83 30.1,9.83 29.95,9.68 29.11,9.68 R6.2 28.96,9.83 26.52,12.27 C1.1 26.36,12.5 23.47,12.5 23.39,12.57 R5.2
N$9
  Top 0.5: AND6.2 39.47,12.19 38.18,10.9 36.88,10.9 R7.2
N$10
  Top 0.5: Q8.3 34.14,8.91 34.37,9.14 36.8,9.14 R7.1 37.03,9.07 37.72,8.38 R8.1
N$11
  Top 0.5: IC4.7 17.14,31.17 18.14,30.18 22.86,30.18 OR1.1
N$13
  Top 0.5: OR2.2 18.36,19.05 18.9,18.52 18.9,13.18 20.27,11.81 AND1.4
N$14
  Top 0.5: OR3.2 24.16,21.57 24.77,21.57 25.6,20.73 25.6,17.68 26.36,16.92 26.36,16.15 25.38,15.16 XOR1.4
N$15
  Top 0.5: OR1.4 25.45,28.19 25.45,25.22 29.18,21.49 29.18,21.34 OR4.1
N$16  (via drill 0.4)
  Top 0.5: v30.4,8.99 30.4,7.54 29.49,6.63 29.49,5.33 R9.1 | v35.36,13.95 36.58,13.95 Q9.3 36.8,13.87 37.49,13.18 40.01,13.18 AND6.1
  Bottom 0.5: v35.36,13.95 v30.4,8.99
N$27
  Top 0.5: AND4.4 17.83,43.51 19.66,45.34 20.27,45.34 AND5.1
N$30
  Top 0.5: R31.2 R28.1
N$31
  Top 0.5: R27.1 5.11,25.76 5.11,22.48 R30.2 5.26,22.33 6.4,21.18 6.4,19.89 6.71,19.58 8.84,19.58 10.59,21.34 IC3.5 10.82,21.49 10.82,23.09 13.34,25.6 IC3.2
N$33
  Top 0.5: AND2.1 17.75,27.58 15.32,27.58 14.63,26.9 IC3.1
N$34
  Top 0.5: AND2.2 17.22,26.67 13.34,22.78 IC3.7
N$35
  Top 0.5: R37.2 R34.1
N$36
  Top 0.5: R33.1 5.11,14.33 5.11,11.05 R36.2 5.26,10.9 6.4,9.75 6.4,8.46 6.71,8.15 8.84,8.15 10.59,9.91 IC5.5 10.82,10.06 10.82,12.5 13.34,15.01 IC5.2
N$38
  Top 0.5: IC5.7 13.34,11.2 14.78,12.65 17.75,12.65 AND1.2
N$39
  Top 0.5: AND1.1 17.75,13.72 16.31,13.72 14.63,15.39 IC5.1
N$40
  Top 0.5: R38.1 10.21,34.67 10.21,32.61 R39.2 10.44,32.54 11.35,31.62 14.55,31.62 IC4.5 14.63,31.85 14.63,34.06 15.85,35.28 15.85,36.96 IC4.3
N$43
  Top 0.5: OR1.2 22.94,29.26 23.47,29.26 23.93,29.72 23.93,30.63 21.87,32.69 19.66,32.69 18.44,33.91 18.44,36.96 IC4.1
N$50  (via drill 0.4)
  Top 0.5: v16.61,20.57 17.14,20.04 17.75,20.04 OR2.1 | v20.27,24.23 20.27,25.68 AND2.4
  Bottom 0.5: v20.27,24.23 v16.61,20.57
N$53
  Top 0.5: AND3.4 12.72,43.51 14.55,45.34 15.24,45.34 AND4.1
N$58
  Top 0.5: AND5.4 22.86,43.43 25.07,43.43 25.38,43.13 25.68,43.13 Q1.1
N$61
  Top 0.5: R46.2 39.17,21.64 37.03,21.64 R45.2 36.88,21.41 36.88,20.04 35.43,18.59 35.43,16.76 35.13,16.46 33.15,16.46 32.77,16.84 32.77,25.76 31.09,27.43 Q5.3 31.09,27.74 31.09,35.28 33.6,37.8 33.6,38.25 IC9.7
N$62
  Top 0.5: C9.1 34.14,17.83 34.14,21.57 R45.1 34.06,21.79 34.06,32.46 33.83,32.69 IC9.2 33.68,32.92 33.68,36.58 34.9,37.8 34.9,38.25 IC9.6
N$63
  Top 0.5: OR4.2 29.18,20.34 26.9,20.34 26.67,20.57 OR3.4
N$64
  Top 0.5: IC9.4 36.2,27.13 36.65,26.67 R44.2
N$66
  Top 0.5: IC9.5 36.2,35.51 39.55,32.16 39.55,30.86 C10.1
NO_IMP  (via drill 0.4)
  Top 0.5: R8.2 41.3,8.38 41.3,9.98 42.52,11.2 AND6.4 42.75,11.12 47.85,11.12 49.53,9.45 JP1.1 | v25.22,36.96 21.87,36.96 Q4.1 | v32,43.74 32.84,43.74 33.22,44.12 Q3.1
  Bottom 0.5: v25.22,36.96 v32,43.74 32.23,43.66 41.38,34.52 48.54,34.52 49.53,33.53 JP1.1
PRE  (via drill 0.4)
  Top 0.5: v16.46,43.59 16.46,43.81 15.85,44.42 15.32,44.42 AND4.2 | v5.94,38.25 4.88,38.25 3.81,39.32 J3.3
  Bottom 0.5: v16.46,43.59 22.1,43.59 22.78,44.27 22.78,44.88 22.25,45.41 9.6,45.41 5.94,41.76 v5.94,38.25
RED
  Bottom 1: VR2.B1 48.01,17.14 38.1,7.24 J4.3
TS_OFF_BAT  (via drill 0.4)
  Top 0.5: R29.2 2.59,22.48 2.59,25.76 R26.1 2.82,25.83 v3.66,26.67 | AND5.2 20.27,44.42 19.74,44.42 19.28,43.97 19.28,37.57 21.79,35.05 Q4.2 21.49,35.05 v19.96,33.53 | v20.42,16.38 20.57,16.54 23.39,16.54 XOR1.1 | v12.5,20.04 12.5,21.03 12.12,21.41 IC3.6 | v12.04,25.45 12.04,26.82 IC3.3
  Bottom 0.5: v3.66,26.67 3.66,30.1 2.52,31.24 2.52,35.51 3.81,36.8 J3.4 3.58,36.27 13.14,26.71 | v20.42,16.38 16.15,16.38 v12.5,20.04 12.42,20.27 12.04,20.65 v12.04,25.45 12.12,25.68 13.14,26.71 | 13.14,26.71 v19.96,33.53
TS_OFF_INV  (via drill 0.4)  (1 unrouted)
  Top 0.5: R32.1 2.59,14.33 2.59,11.05 R35.2 2.67,10.82 3.5,9.98 3.5,8.23 4.34,7.39 9.91,7.39 12.04,9.53 12.04,9.98 IC5.6 12.04,10.21 v12.04,12.57 | v11.2,14.02 12.04,14.86 12.04,15.39 IC5.3
  Bottom 0.5: v12.04,12.57 11.2,13.41 v11.2,14.02 11.12,14.25 11.12,27.2 4.04,34.29 J3.5